# EAGLE schematic schematic (EAGLE 9.2.0)
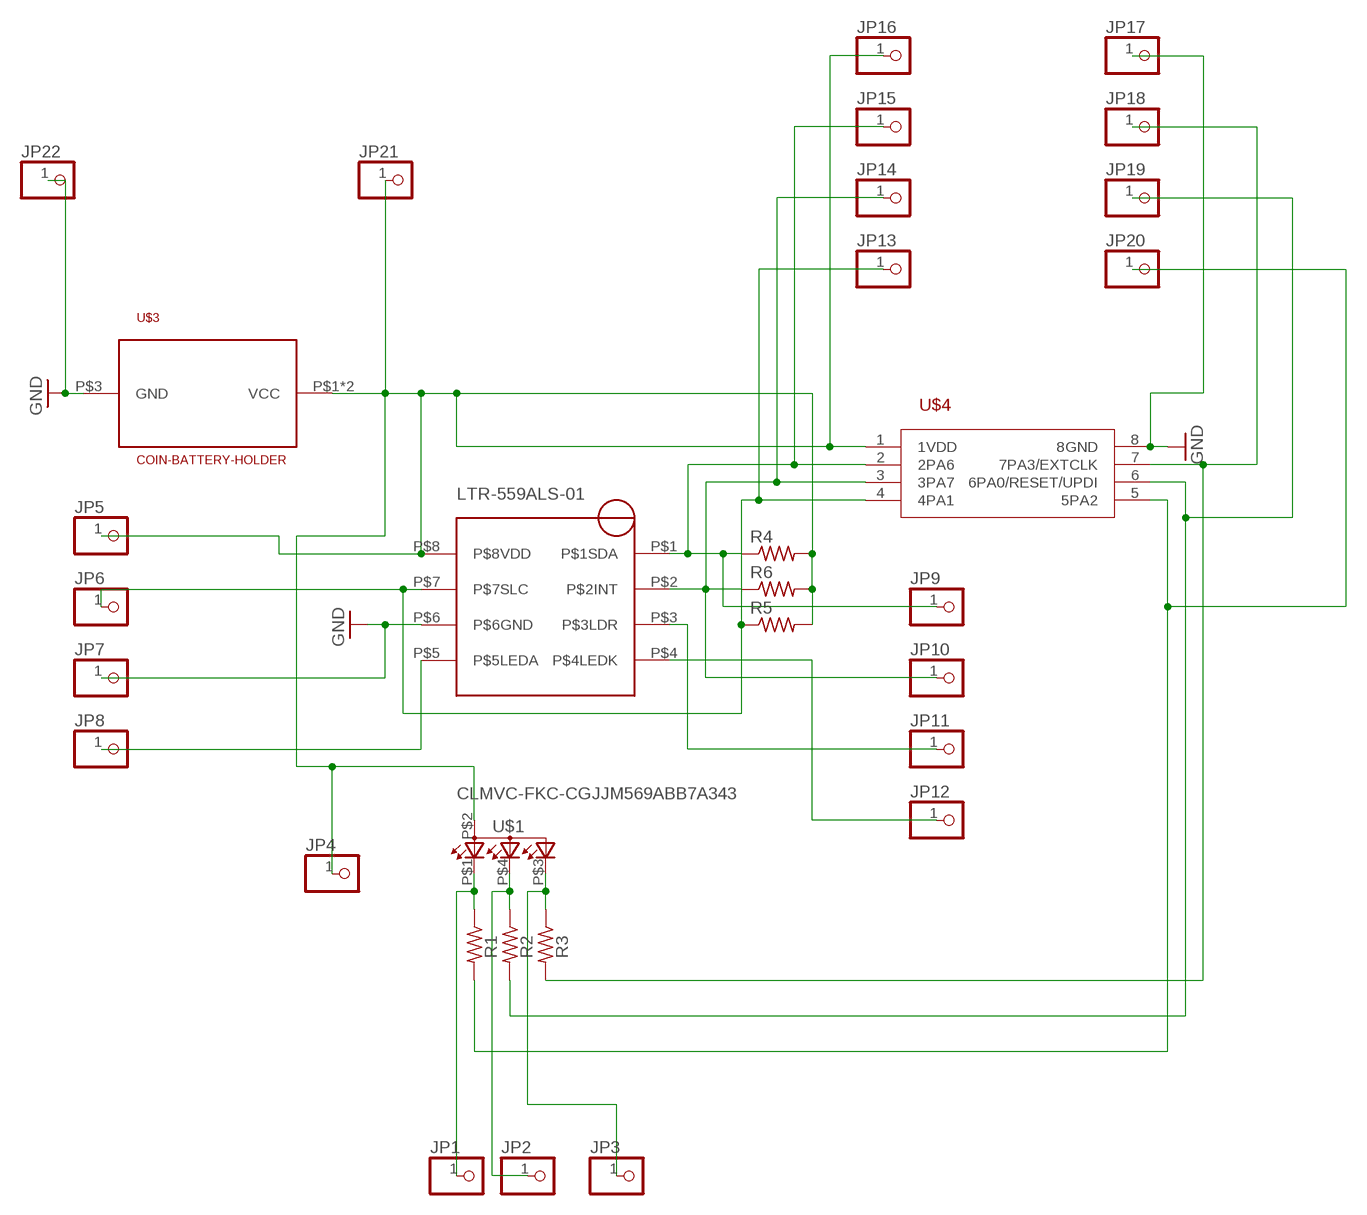
[diagram p0: schematic, sheet 1]

## Parts
JP1  PINHD-1X1  [1X01]
JP2  PINHD-1X1  [1X01]
JP3  PINHD-1X1  [1X01]
JP4  PINHD-1X1  [1X01]
JP5  PINHD-1X1  [1X01]
JP6  PINHD-1X1  [1X01]
JP7  PINHD-1X1  [1X01]
JP8  PINHD-1X1  [1X01]
JP9  PINHD-1X1  [1X01]
JP10  PINHD-1X1  [1X01]
JP11  PINHD-1X1  [1X01]
JP12  PINHD-1X1  [1X01]
JP13  PINHD-1X1  [1X01]
JP14  PINHD-1X1  [1X01]
JP15  PINHD-1X1  [1X01]
JP16  PINHD-1X1  [1X01]
JP17  PINHD-1X1  [1X01]
JP18  PINHD-1X1  [1X01]
JP19  PINHD-1X1  [1X01]
JP20  PINHD-1X1  [1X01]
JP21  PINHD-1X1  [1X01]
JP22  PINHD-1X1  [1X01]
R1  R-US_R0805  [R0805]
R2  R-US_R0805  [R0805]
R3  R-US_R0805  [R0805]
R4  R-US_R0805  [R0805]
R5  R-US_R0805  [R0805]
R6  R-US_R0805  [R0805]
U$1  CLMVC-FKC-CGJJM569ABB7A343  [CLMVC-FKC-CGJJM569ABB7A343]
U$2  LTR-559ALS-01  [LTR-559ALS-01]
U$3  COIN-BATTERY-HOLDER  [3034_C]
U$4  ATTINY402-SSNR  [SOIC127P600X175-8N]

## Nets
GND: JP7.1 JP17.1 JP22.1 U$2.P$6(P$6GND) U$3.P$3(GND) U$4.8(8GND)
N$1: JP3.1 R3.1 U$1.P$3(CGREEN)
N$2: JP2.1 R2.1 U$1.P$4(CBLUE)
N$3: JP1.1 R1.1 U$1.P$1(CRED)
N$4: JP8.1 U$2.P$5(P$5LEDA)
N$5: JP18.1 R3.2 U$4.7(7PA3/EXTCLK)
N$6: JP19.1 R2.2 U$4.6(6PA0/RESET/UPDI)
N$7: JP20.1 R1.2 U$4.5(5PA2)
N$8: JP9.1 JP15.1 R4.1 U$2.P$1(P$1SDA) U$4.2(2PA6)
N$9: JP10.1 JP14.1 R6.1 U$2.P$2(P$2INT) U$4.3(3PA7)
N$10: JP6.1 JP13.1 R5.1 U$2.P$7(P$7SLC) U$4.4(4PA1)
N$11: JP4.1 JP5.1 JP16.1 JP21.1 R4.2 R5.2 R6.2 U$1.P$2(GND) U$2.P$8(P$8VDD) U$3.P$1(VCC) U$3.P$2(VCC) U$4.1(1VDD)
N$15: JP11.1 U$2.P$3(P$3LDR)
N$16: JP12.1 U$2.P$4(P$4LEDK)

## Library data of the parts
JP1-JP22 = pinhead:PINHD-1X1: PIN HEADER
R1-R6 = rcl:R-US_: RESISTOR, American symbol; SPICEPREFIX: R
U$1 = CLMVC-FKC-CGJJM569aBB7a343:CLMVC-FKC-CGJJM569ABB7A343
U$2 = LTR-559ALS-01:LTR-559ALS-01
U$3 = coin-battery-holder:COIN-BATTERY-HOLDER
U$4 = SOIC127P600X175-8N:ATTINY402-SSNR

## Net classes
0 default: width 0.127 mm, clearance 0.127 mm